# EAGLE design EIT_Recorder (EAGLE 9.6.2)

## Sheet 1 of 2: DIGITAL
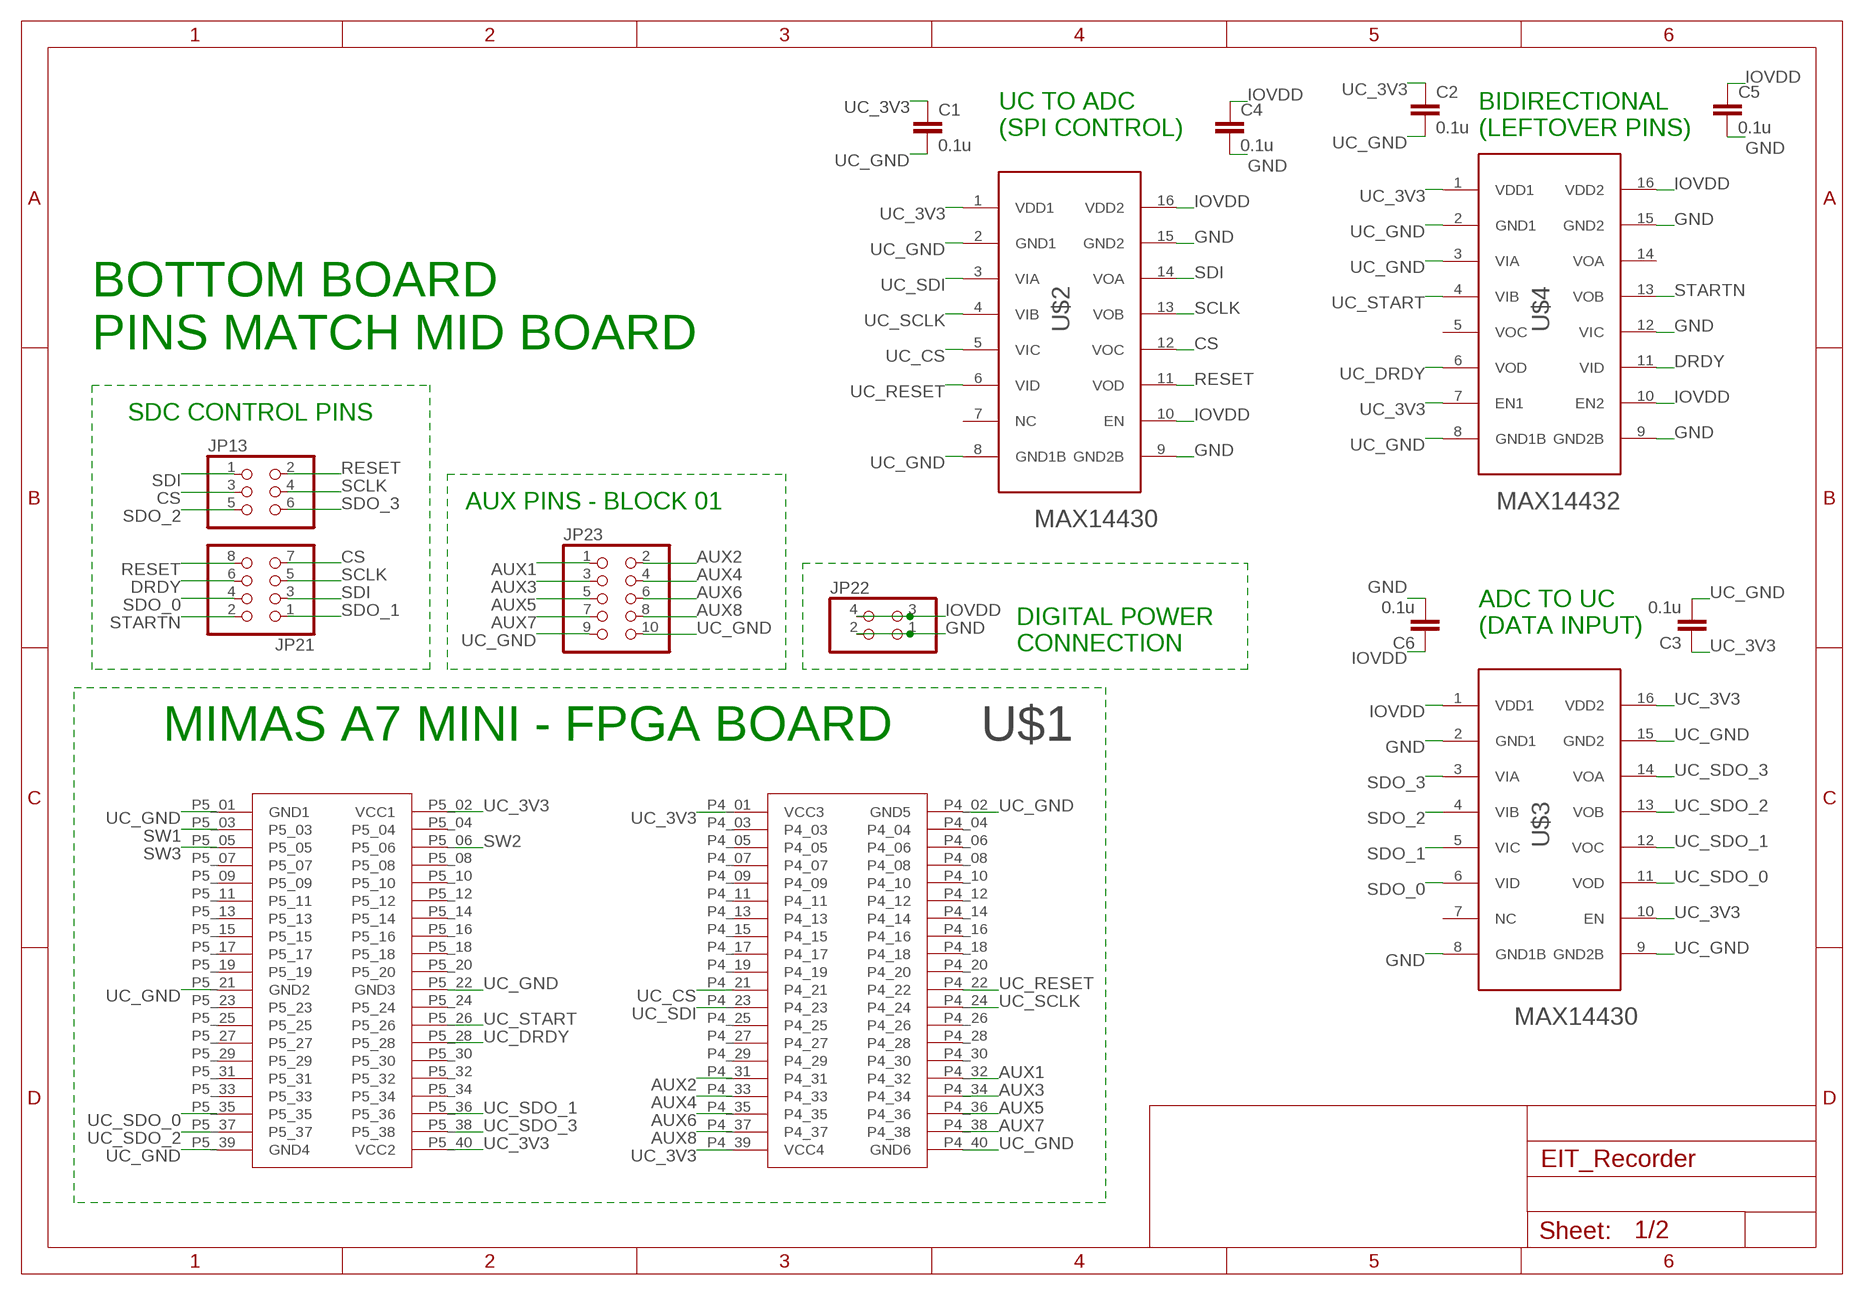
[diagram p0: schematic, sheet 1]

### Parts
C1  0.1u  C-EUC0805  [C0805]
C2  0.1u  C-EUC0805  [C0805]
C3  0.1u  C-EUC0805  [C0805]
C4  0.1u  C-EUC0805  [C0805]
C5  0.1u  C-EUC0805  [C0805]
C6  0.1u  C-EUC0805  [C0805]
JP13  PINHD-2X3  [2X03]
JP21  PINHD-2X4  [2X04]
JP22  PINHD-2X2  [2X02]
JP23  PINHD-2X5/90  [2X05/90]
U$1  MIMAS_A7_MINI  [MIMAS_A7_MINI]
U$2  MAX14430  [SOIC16_CUSTOM]
U$3  MAX14430  [SOIC16_CUSTOM]
U$4  MAX14432  [SOIC16_CUSTOM]

### Nets
AUX1: JP23.1 U$1.P4_32
AUX2: JP23.2 U$1.P4_31
AUX3: JP23.3 U$1.P4_34
AUX4: JP23.4 U$1.P4_33
AUX5: JP23.5 U$1.P4_36
AUX6: JP23.6 U$1.P4_35
AUX7: JP23.7 U$1.P4_38
AUX8: JP23.8 U$1.P4_37
CS: JP13.3 JP21.7 U$2.12(VOC)
DRDY: JP21.6 U$4.11(VID)
GND: C4.2 C5.2 C6.2 JP22.1 JP22.2 U$2.9(GND2B) U$2.15(GND2) U$3.2(GND1) U$3.8(GND1B) U$4.9(GND2B) U$4.12(VIC) U$4.15(GND2)
IOVDD: C4.1 C5.1 C6.1 JP22.3 JP22.4 U$2.10(EN) U$2.16(VDD2) U$3.1(VDD1) U$4.10(EN2) U$4.16(VDD2)
RESET: JP13.2 JP21.8 U$2.11(VOD)
SCLK: JP13.4 JP21.5 U$2.13(VOB)
SDI: JP13.1 JP21.3 U$2.14(VOA)
SDO_0: JP21.4 U$3.6(VID)
SDO_1: JP21.1 U$3.5(VIC)
SDO_2: JP13.5 U$3.4(VIB)
SDO_3: JP13.6 U$3.3(VIA)
STARTN: JP21.2 U$4.13(VOB)
SW1: U$1.P5_03 ; also sheet 2
SW2: U$1.P5_06 ; also sheet 2
SW3: U$1.P5_05 ; also sheet 2
UC_3V3: C1.1 C2.1 C3.1 U$1.P4_01(VCC3) U$1.P4_39(VCC4) U$1.P5_02(VCC1) U$1.P5_40(VCC2) U$2.1(VDD1) U$3.10(EN) U$3.16(VDD2) U$4.1(VDD1) U$4.7(EN1) ; also sheet 2
UC_CS: U$1.P4_21 U$2.5(VIC)
UC_DRDY: U$1.P5_28 U$4.6(VOD)
UC_GND: C1.2 C2.2 C3.2 JP23.9 JP23.10 U$1.P4_02(GND5) U$1.P4_40(GND6) U$1.P5_01(GND1) U$1.P5_21(GND2) U$1.P5_22(GND3) U$1.P5_39(GND4) U$2.2(GND1) U$2.8(GND1B) U$3.9(GND2B) U$3.15(GND2) U$4.2(GND1) U$4.3(VIA) U$4.8(GND1B) ; also sheet 2
UC_RESET: U$1.P4_22 U$2.6(VID)
UC_SCLK: U$1.P4_24 U$2.4(VIB)
UC_SDI: U$1.P4_23 U$2.3(VIA)
UC_SDO_0: U$1.P5_35 U$3.11(VOD)
UC_SDO_1: U$1.P5_36 U$3.12(VOC)
UC_SDO_2: U$1.P5_37 U$3.13(VOB)
UC_SDO_3: U$1.P5_38 U$3.14(VOA)
UC_START: U$1.P5_26 U$4.4(VIB)
Unconnected: U$1.P4_03 U$1.P4_04 U$1.P4_05 U$1.P4_06 U$1.P4_07 U$1.P4_08 U$1.P4_09 U$1.P4_10 U$1.P4_11 U$1.P4_12 U$1.P4_13 U$1.P4_14 U$1.P4_15 U$1.P4_16 U$1.P4_17 U$1.P4_18 U$1.P4_19 U$1.P4_20 U$1.P4_25 U$1.P4_26 U$1.P4_27 U$1.P4_28 U$1.P4_29 U$1.P4_30 U$1.P5_04 U$1.P5_07 U$1.P5_08 U$1.P5_09 U$1.P5_10 U$1.P5_11 U$1.P5_12 U$1.P5_13 U$1.P5_14 U$1.P5_15 U$1.P5_16 U$1.P5_17 U$1.P5_18 U$1.P5_19 U$1.P5_20 U$1.P5_23 U$1.P5_24 U$1.P5_25 U$1.P5_27 U$1.P5_29 U$1.P5_30 U$1.P5_31 U$1.P5_32 U$1.P5_33 U$1.P5_34 U$2.7(NC) U$3.7(NC) U$4.5(VOC) U$4.14(VOA)

### Notes on the sheet
- UC TO ADC
  (SPI CONTROL)
- BIDIRECTIONAL
  (LEFTOVER PINS)
- BOTTOM BOARD
  PINS MATCH MID BOARD
- SDC CONTROL PINS
- AUX PINS - BLOCK 01
- ADC TO UC
  (DATA INPUT)
- DIGITAL POWER 
  CONNECTION
- MIMAS A7 MINI - FPGA BOARD

## Sheet 2 of 2: TOP BOARD CONNECTOR MATCHING
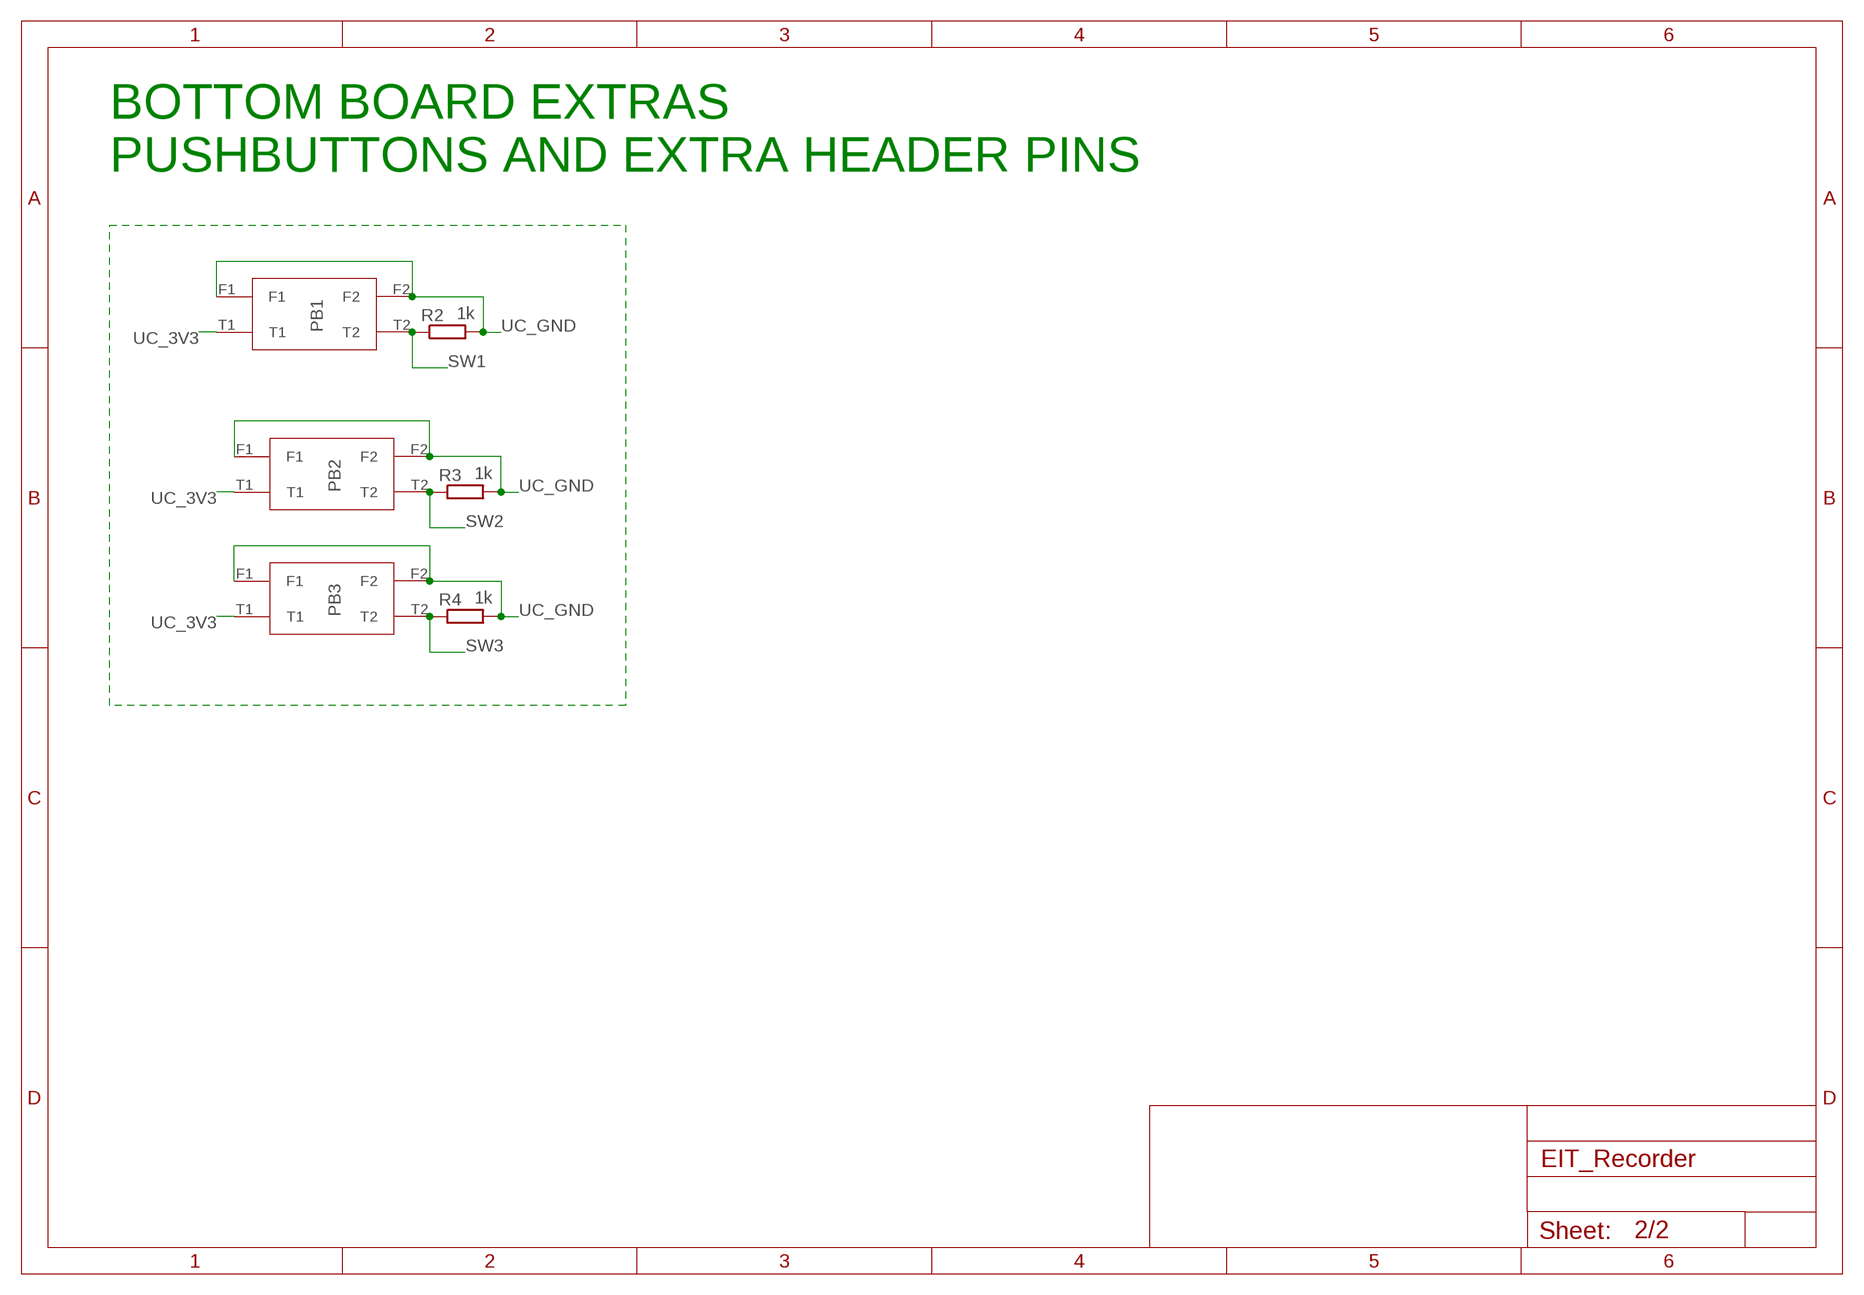
[diagram p1: schematic, sheet 2]

### Parts
PB1  PUSHBUTTON_95C06B2RAT  [PUSHBUTTON_95C06B2RAT]
PB2  PUSHBUTTON_95C06B2RAT  [PUSHBUTTON_95C06B2RAT]
PB3  PUSHBUTTON_95C06B2RAT  [PUSHBUTTON_95C06B2RAT]
R2  1k  R-EU_R0805  [R0805]
R3  1k  R-EU_R0805  [R0805]
R4  1k  R-EU_R0805  [R0805]

### Nets
SW1: PB1.T2 R2.1 ; also sheet 1
SW2: PB2.T2 R3.1 ; also sheet 1
SW3: PB3.T2 R4.1 ; also sheet 1
UC_3V3: PB1.T1 PB2.T1 PB3.T1 ; also sheet 1
UC_GND: PB1.F1 PB1.F2 PB2.F1 PB2.F2 PB3.F1 PB3.F2 R2.2 R3.2 R4.2 ; also sheet 1

### Notes on the sheet
- BOTTOM BOARD EXTRAS
  PUSHBUTTONS AND EXTRA HEADER PINS

## Library data of the parts
C1-C6 = rcl:C-EU: CAPACITOR, European symbol; SPICEPREFIX: C
JP13 = pinhead:PINHD-2X3: PIN HEADER
JP21 = pinhead:PINHD-2X4: PIN HEADER
JP22 = pinhead:PINHD-2X2: PIN HEADER
JP23 = pinhead:PINHD-2X5: PIN HEADER
PB1-PB3 = EIT_Recorder:PUSHBUTTON_95C06B2RAT
R2-R4 = rcl:R-EU_: RESISTOR, European symbol; SPICEPREFIX: R
U$1 = EIT_Recorder:MIMAS_A7_MINI
U$2 U$3 = EIT_Recorder:MAX14430
U$4 = EIT_Recorder:MAX14432

## Board
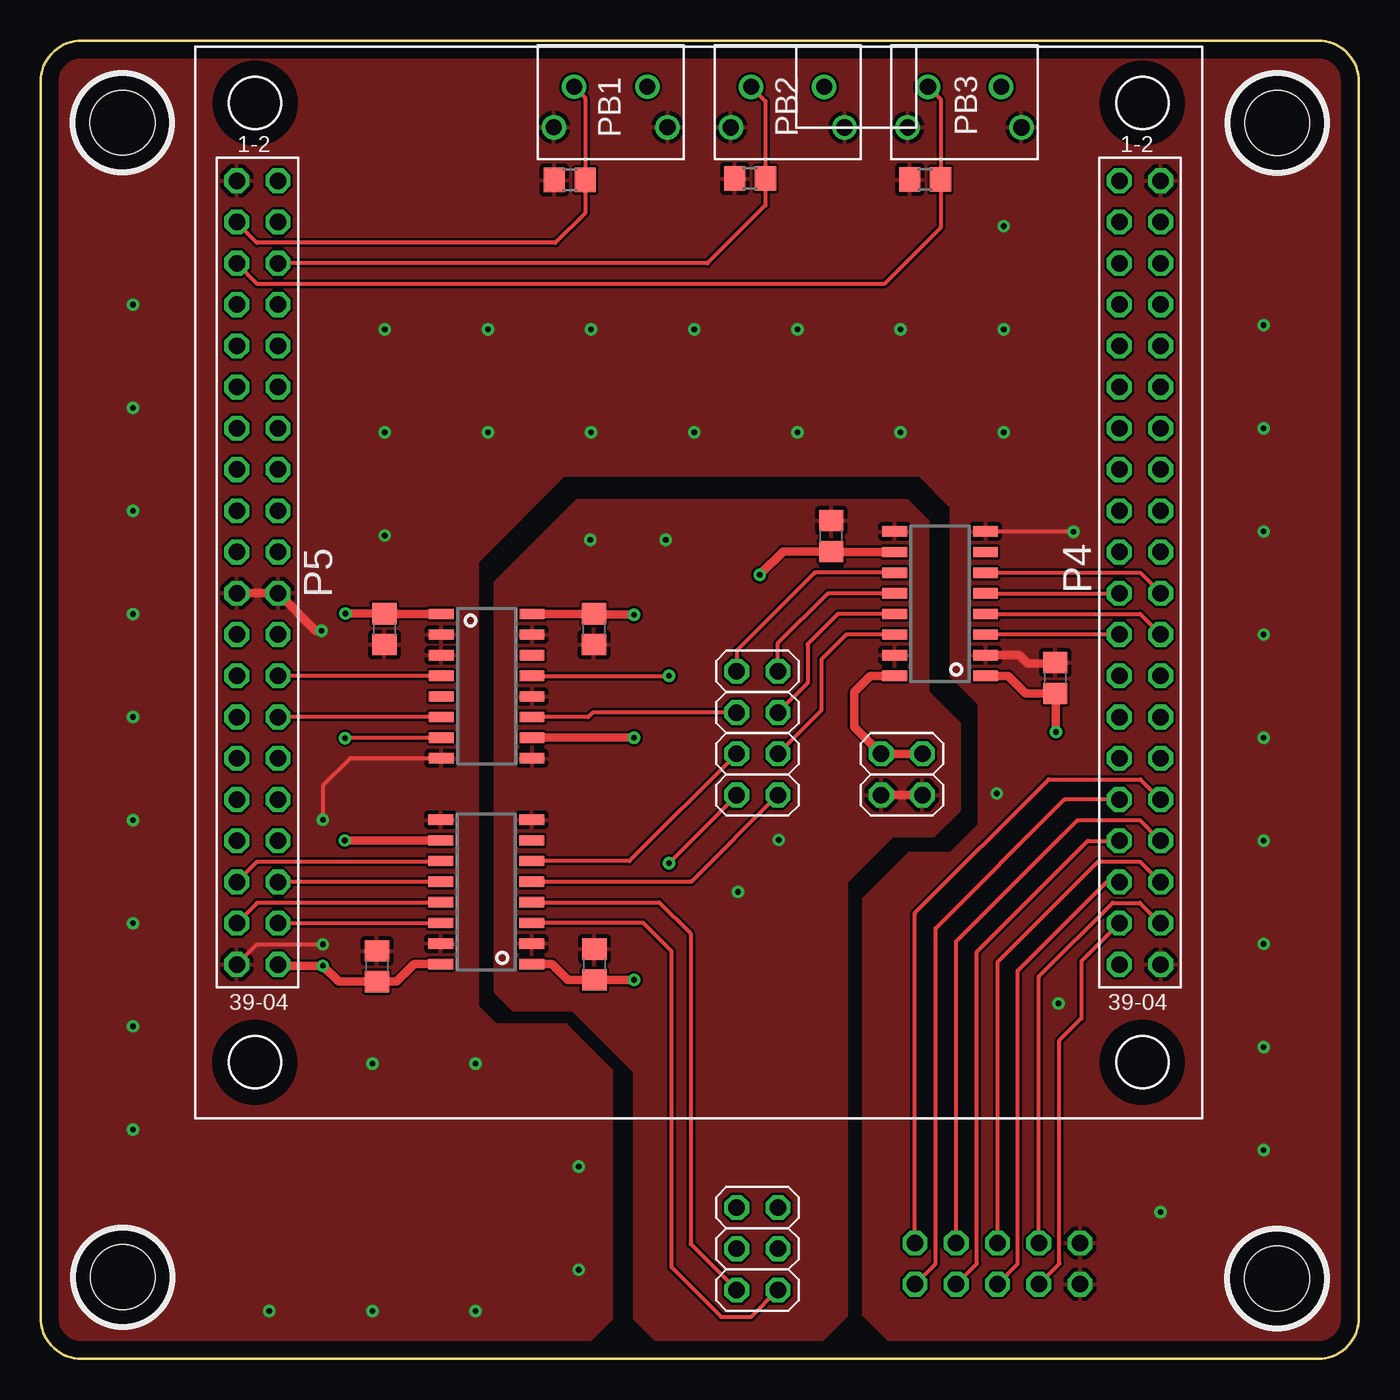
[diagram p2: board, top side]
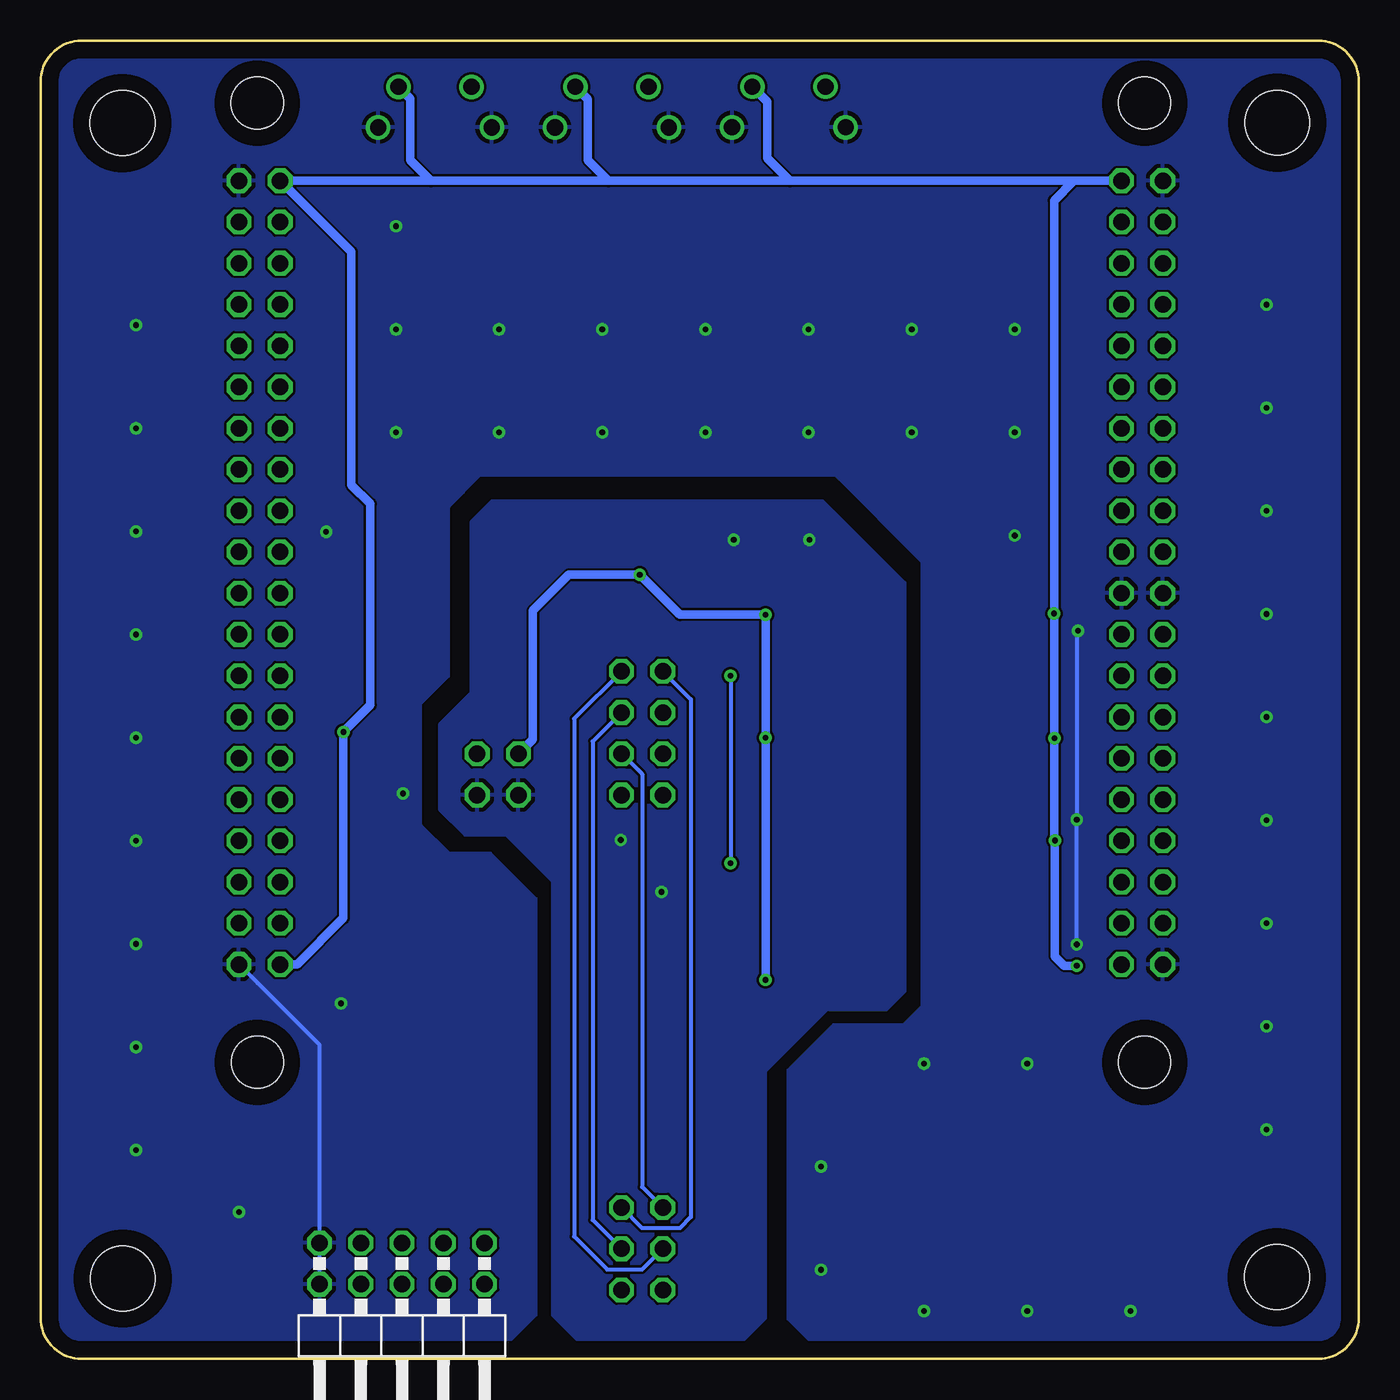
[diagram p3: board, bottom side, seen from below]

Size 81.15 x 81.18 mm. Coordinates in mm from the lower left corner, seen from the top.
Outline: 0,78.64 0,2.54 arc90 2.54,0 78.61,0 arc90 81.15,2.54 81.15,78.64 arc90 78.61,81.18 2.54,81.18 arc90 0,78.64
Copper layers (1*16): Top 0.035mm / dielectric 1.5mm / Bottom 0.035mm
Design rules "default *": minimum track width 6mil, minimum drill 0.35mm, track to track 6mil, track to pad 6mil, pad to pad 6mil, via to via 6mil, smd to smd 6mil, copper to edge 40mil, drill to drill 6mil, minimum pad ring 10mil, minimum via ring 8mil, stop-mask expansion 4mil, vias tented up to drill 0mil, thermal gap 10mil
Holes 3.99 mm at 76.12,76.1 5.03,76.12 76.1,4.95 5.05,5.03
Holes 3.2 mm at 13.2,77.33 67.82,77.33 13.2,18.27 67.81,18.27

### Footprints (pad centres in the part's own frame; a part is rotated, then mirrored left to right if it is on the bottom)
C0805 = smd 1.3 x 1.5: 1 -0.95,0; 2 0.95,0
2X03 = drill 1.016 octagon: 1 -2.54,-1.27; 2 -2.54,1.27; 3 0,-1.27; 4 0,1.27; 5 2.54,-1.27; 6 2.54,1.27
2X04 = drill 1.016 octagon: 1 -3.81,-1.27; 2 -3.81,1.27; 3 -1.27,-1.27; 4 -1.27,1.27; 5 1.27,-1.27; 6 1.27,1.27; 7 3.81,-1.27; 8 3.81,1.27
2X02 = drill 1.016 octagon: 1 -1.27,-1.27; 2 -1.27,1.27; 3 1.27,-1.27; 4 1.27,1.27
2X05/90 = drill 1.016 octagon: 1 -5.08,-6.35; 2 -5.08,-3.81; 3 -2.54,-6.35; 4 -2.54,-3.81; 5 0,-6.35; 6 0,-3.81; 7 2.54,-6.35; 8 2.54,-3.81; 9 5.08,-6.35; 10 5.08,-3.81
PUSHBUTTON_95C06B2RAT = drill 1: F1 -3.45,1.3; F2 3.55,1.3; T1 -2.2,-1.2; T2 2.3,-1.2
R0805 = smd 1.3 x 1.5: 1 -0.95,0; 2 0.95,0
MIMAS_A7_MINI = drill 1.016 octagon: P4_01 29.65,26.42; P4_02 32.19,26.42; P4_03 29.65,23.88; P4_04 32.19,23.88; P4_05 29.65,21.34; P4_06 32.19,21.34; P4_07 29.65,18.8; P4_08 32.19,18.8; P4_09 29.65,16.26; P4_10 32.19,16.26; P4_11 29.65,13.72; P4_12 32.19,13.72; P4_13 29.65,11.18; P4_14 32.19,11.18; P4_15 29.65,8.64; P4_16 32.19,8.64; P4_17 29.65,6.1; P4_18 32.19,6.1; P4_19 29.65,3.56; P4_20 32.19,3.56; P4_21 29.65,1.02; P4_22 32.19,1.02; P4_23 29.65,-1.52; P4_24 32.19,-1.52; P4_25 29.65,-4.06; P4_26 32.19,-4.06; P4_27 29.65,-6.6; P4_28 32.19,-6.6; P4_29 29.65,-9.14; P4_30 32.19,-9.14; P4_31 29.65,-11.68; P4_32 32.19,-11.68; P4_33 29.65,-14.22; P4_34 32.19,-14.22; P4_35 29.65,-16.76; P4_36 32.19,-16.76; P4_37 29.65,-19.3; P4_38 32.19,-19.3; P4_39 29.65,-21.84; P4_40 32.19,-21.84; P5_01 -24.68,26.42; P5_02 -22.14,26.42; P5_03 -24.68,23.88; P5_04 -22.14,23.88; P5_05 -24.68,21.34; P5_06 -22.14,21.34; P5_07 -24.68,18.8; P5_08 -22.14,18.8; P5_09 -24.68,16.26; P5_10 -22.14,16.26; P5_11 -24.68,13.72; P5_12 -22.14,13.72; P5_13 -24.68,11.18; P5_14 -22.14,11.18; P5_15 -24.68,8.64; P5_16 -22.14,8.64; P5_17 -24.68,6.1; P5_18 -22.14,6.1; P5_19 -24.68,3.56; P5_20 -22.14,3.56; P5_21 -24.68,1.02; P5_22 -22.14,1.02; P5_23 -24.68,-1.52; P5_24 -22.14,-1.52; P5_25 -24.68,-4.06; P5_26 -22.14,-4.06; P5_27 -24.68,-6.6; P5_28 -22.14,-6.6; P5_29 -24.68,-9.14; P5_30 -22.14,-9.14; P5_31 -24.68,-11.68; P5_32 -22.14,-11.68; P5_33 -24.68,-14.22; P5_34 -22.14,-14.22; P5_35 -24.68,-16.76; P5_36 -22.14,-16.76; P5_37 -24.68,-19.3; P5_38 -22.14,-19.3; P5_39 -24.68,-21.84; P5_40 -22.14,-21.84
SOIC16_CUSTOM = smd 0.635 x 1.524: 1 -4.445,-2.795; 2 -3.175,-2.795; 3 -1.905,-2.795; 4 -0.635,-2.795; 5 0.635,-2.795; 6 1.905,-2.795; 7 3.175,-2.795; 8 4.445,-2.795; 9 4.445,2.795; 10 3.175,2.795; 11 1.905,2.795; 12 0.635,2.795; 13 -0.635,2.795; 14 -1.905,2.795; 15 -3.175,2.795; 16 -4.445,2.795

### Placement (x,y rotation side)
C1  21.16,44.93 270 top
C2  20.7,24.18 90 top
C3  62.46,41.94 90 top
C4  48.67,50.67 90 top
C5  34.09,24.28 90 top
C6  34.06,44.93 270 top
JP13  44.12,6.78 270 top
JP21  44.12,38.53 90 top
JP22  53.01,35.99 90 top
JP23  58.9,0.79 180 bottom
PB1  35.14,77.14 180 top
PB2  46.04,77.13 180 top
PB3  56.93,77.13 180 top
R2  32.58,72.6 180 top
R3  43.67,72.69 180 top
R4  54.45,72.62 180 top
U$1  36.75,46.13 0 top
U$2  55.37,46.51 90 top
U$3  27.43,28.75 90 top
U$4  27.46,41.43 270 top

### Tracks (layer width: path | path; a pad name or v marks a point on that pad's centre or on a via)
AUX1
  Top 0.254: JP23.1 53.82,27.46 62.05,35.69 67.69,35.69 68.93,34.45 U$1.P4_32
AUX2
  Top 0.254: JP23.2 55.09,5.87 55.09,26.52 63.02,34.44 U$1.P4_31
AUX3
  Top 0.254: JP23.3 56.36,25.7 63.83,33.17 67.67,33.17 68.93,31.91 U$1.P4_34
AUX4
  Top 0.254: JP23.4 57.63,5.87 57.63,25.07 64.47,31.9 U$1.P4_33
AUX5
  Top 0.254: JP23.5 58.9,24.43 65.1,30.63 67.67,30.63 68.93,29.37 U$1.P4_36
AUX6
  Top 0.254: JP23.6 60.15,5.84 60.15,23.9 65.61,29.37 U$1.P4_35
AUX7
  Top 0.254: JP23.7 61.44,23.55 65.99,28.09 67.67,28.09 68.93,26.83 U$1.P4_38
AUX8
  Top 0.254: JP23.8 62.71,5.87 62.71,19.61 64.06,20.96 64.06,24.48 U$1.P4_37
CS
  Top 0.254: JP21.7 45.39,44.07 48.43,47.1 48.46,47.14 U$2.12
  Bottom 0.254: JP21.7 48.31,39.42 48.31,7.54 46.28,5.51 44.12,5.51 JP13.3
DRDY
  Top 0.254: JP21.6 33.99,39.8 33.71,39.52 U$4.11
GND  (via drill 0.35)
  Top 0.508: JP22.2 JP22.1
  other vias: 45.44,31.95 33.83,50.44 38.48,50.44 42.93,28.75
  pour Bottom: 27.99,47.78 27.99,22.63 29.11,21.51 32.77,21.51 36.58,17.7 36.58,2.51 39.95,-0.86 46.05,-0.86 49.61,2.69 49.61,29.41 52.45,32.26 54.99,32.26 56.54,33.81 56.54,39.09 54.61,41.02 54.61,51.56 53.34,52.83 33.05,52.83
  pour Top: 27.99,47.78 27.99,22.63 29.11,21.51 32.77,21.51 36.58,17.7 36.58,2.51 39.95,-0.86 46.05,-0.86 49.61,2.69 49.61,29.41 52.45,32.26 54.99,32.26 56.54,33.81 56.54,39.09 54.61,41.02 54.61,51.56 53.34,52.83 33.05,52.83
IOVDD  (via drill 0.35)
  Top 0.508: JP22.3 JP22.4 50.09,38.91 50.09,41.07 51.08,42.06 U$2.16 | U$3.1 31.47,24.31 32.45,23.33 C5.1 36.52,23.33 v36.53,23.34 | U$2.10 48.71,49.68 C4.1 45.71,49.72 v44.27,48.29 | U$4.10 v36.53,38.25 | v36.53,45.82 34.12,45.82 C6.1 U$4.16
  Bottom 0.508: v36.53,23.34 v36.53,38.25 v36.53,45.82 41.81,45.82 v44.27,48.29 48.64,48.29 50.85,46.08 50.85,38.15 JP22.4
RESET
  Top 0.254: JP21.8 42.85,43.61 47.63,48.39 47.65,48.41 U$2.11
  Bottom 0.254: JP21.8 41.12,40.61 41.12,8.74 41.81,8.05 44.12,8.05 JP13.2
SCLK
  Top 0.254: JP21.5 47.22,41.63 47.22,44.02 49.07,45.87 U$2.13
  Bottom 0.254: JP21.5 47.17,38.02 47.17,8.56 JP13.4
SDI
  Top 0.254: JP21.3 48.06,39.94 48.06,43.06 49.61,44.6 U$2.14
  Bottom 0.254: JP21.3 45.36,37.26 44.12,36.02 44.12,10.59 JP13.1
SDO_0
  Top 0.254: JP21.4 36.25,30.66 U$3.6
SDO_1
  Top 0.254: JP21.1 40.08,29.41 40.06,29.39 U$3.5
SDO_2
  Top 0.254: JP13.5 40.01,7.09 40.01,26.19 38.1,28.09 38.07,28.12 U$3.4
SDO_3
  Top 0.254: JP13.6 43.74,2.59 41.88,2.59 38.84,5.64 38.84,25.1 37.08,26.85 U$3.3
STARTN  (via drill 0.35)
  Top 0.254: JP21.2 42.85,34.7 v38.68,30.53 | U$4.13 v38.68,42.06
  Bottom 0.254: v38.68,42.06 v38.68,30.53
SW1
  Top 0.254: PB1.T2 33.53,77.66 R2.1 33.53,70.56 31.69,68.73 13.31,68.73 12.07,69.97 U$1.P5_03
SW2
  Top 0.254: PB2.T2 44.62,77.45 R3.1 44.62,71.04 41.05,67.46 U$1.P5_06
SW3
  Top 0.254: PB3.T2 55.4,77.56 R4.1 55.4,69.67 51.92,66.19 13.35,66.19 U$1.P5_05
UC_3V3  (via drill 0.35)
  Top 0.254: 14.61,24.21 U$1.P5_40 | U$4.7 24.64,38.23 v18.75,38.23
  Top 0.508: 14.61,24.21 14.62,24.21 v17.37,24.21 18.35,23.23 C2.1 21.94,23.23 23.01,24.31 U$3.16 | U$4.1 21.17,45.87 C1.1 21.13,45.91 18.78,45.91 v18.77,45.9 | v18.72,31.93 U$3.10 | U$2.1 59.56,42.06 60.64,40.99 C3.1 62.48,40.96 62.48,38.63 v62.51,38.61
  Bottom 0.508: 35.03,72.55 U$1.P5_02 17.55,72.55 18.77,71.32 v18.77,45.9 18.75,45.87 v18.75,38.23 18.75,31.95 v18.72,31.93 18.72,24.79 18.14,24.21 v17.37,24.21 | 35.03,72.55 46.2,72.55 | 46.2,72.55 57.12,72.55 | 57.12,72.55 U$1.P4_01 62.03,68.17 62.03,53.82 60.86,52.65 60.86,40.26 v62.51,38.61 62.51,27.14 65.36,24.29 U$1.P4_39 | PB1.T1 36.42,77.42 36.42,73.94 35.03,72.55 | PB2.T1 47.47,77.57 47.47,73.82 46.2,72.55 | PB3.T1 58.39,77.6 58.39,73.82 57.12,72.55
UC_CS
  Top 0.254: U$2.5 U$1.P4_21
UC_DRDY
  Top 0.254: U$1.P5_28 U$4.6
UC_GND  (via drill 0.35)
  Top 0.254: v17.37,25.53 v17.37,25.52 13.3,25.52 U$1.P5_39 | v63.58,50.93 63.55,50.95 U$2.8 | 14.72,47.03 14.61,47.13 U$1.P5_22 U$1.P5_21 | v17.37,33.2 17.37,35.31 19.05,36.98 U$4.8
  Top 0.508: U$1.P5_21 14.6,47.15 14.72,47.03 | v17.3,44.83 16.93,44.83 U$1.P5_22 | U$2.2 60.25,43.33 60.76,42.82 62.4,42.82 C3.2
  Bottom 0.254: v17.37,25.53 v17.37,33.2 17.37,44.75 v17.3,44.83 | U$1.P4_40 67.79,23.14 63.98,19.33 JP23.9 JP23.10
  other vias: 62.66,21.89 58.85,34.82 59.28,69.75 59.28,63.4 21.18,57.05 59.28,57.05 5.69,39.52 5.69,33.17 5.69,26.82 5.69,20.47 5.69,14.12 20.42,18.19 26.77,18.19 21.18,63.4 21.18,50.7 27.53,57.05 33.88,57.05 40.23,57.05 27.53,63.4 33.88,63.4 40.23,63.4 46.58,57.05 46.58,63.4 52.93,63.4 52.93,57.05 33.12,5.49 33.12,11.84 20.42,2.95 14.07,2.95 26.77,2.95 75.29,38.25 75.29,31.9 75.29,25.55 75.29,19.2 75.29,12.85 68.94,9.04 75.29,63.65 75.29,57.3 75.29,50.95 75.29,44.6 5.69,64.92 5.69,58.57 5.69,52.22 5.69,45.87
  pour Top: -1.8,80.42 -1.8,1.55 1.12,-1.37 31.34,-1.37 35.15,2.44 35.15,17.81 32.36,20.6 28.04,20.6 26.9,21.74 26.9,49.05 32.23,54.38 54.08,54.38 56.03,52.43 56.03,42.01 57.76,40.28 57.76,32.92 55.98,31.14 53.44,31.14 50.65,28.35 50.65,2.69 54.71,-1.37 82.14,-1.37 84.56,1.04 84.56,78.89 80.11,83.34 1.12,83.34
  pour Bottom: -1.8,80.42 -1.8,1.55 1.12,-1.37 31.34,-1.37 35.15,2.44 35.15,17.81 32.36,20.6 28.04,20.6 26.9,21.74 26.9,49.05 32.23,54.38 54.08,54.38 56.03,52.43 56.03,42.01 57.76,40.28 57.76,32.92 55.98,31.14 53.44,31.14 50.65,28.35 50.65,2.69 54.71,-1.37 82.14,-1.37 84.56,1.04 84.56,78.89 80.11,83.34 1.12,83.34
UC_RESET
  Top 0.254: U$1.P4_22 67.68,48.41 U$2.6
UC_SCLK
  Top 0.254: U$2.4 67.68,45.87 U$1.P4_24
UC_SDI
  Top 0.254: U$1.P4_23 U$2.3
UC_SDO_0
  Top 0.254: U$1.P5_35 13.31,30.61 24.59,30.61 U$3.11
UC_SDO_1
  Top 0.254: U$1.P5_36 24.61,29.36 U$3.12
UC_SDO_2
  Top 0.254: U$1.P5_37 13.34,28.09 24.61,28.09 U$3.13
UC_SDO_3
  Top 0.254: U$1.P5_38 24.61,26.82 U$3.14
UC_START
  Top 0.254: U$4.4 U$1.P5_26

### Text on the board
Document: ISO 2/2 | ISO 4/0 | ISO 4/0
tDocu: ADC board v4 (The Tower) / Bottom Board / Enrico Ravagli June 2025 | 01 | 02 | GND